# Altium schematic sheet SoC_1.SchDoc
size A3; SheetNumber: 5; SheetTotal: 10
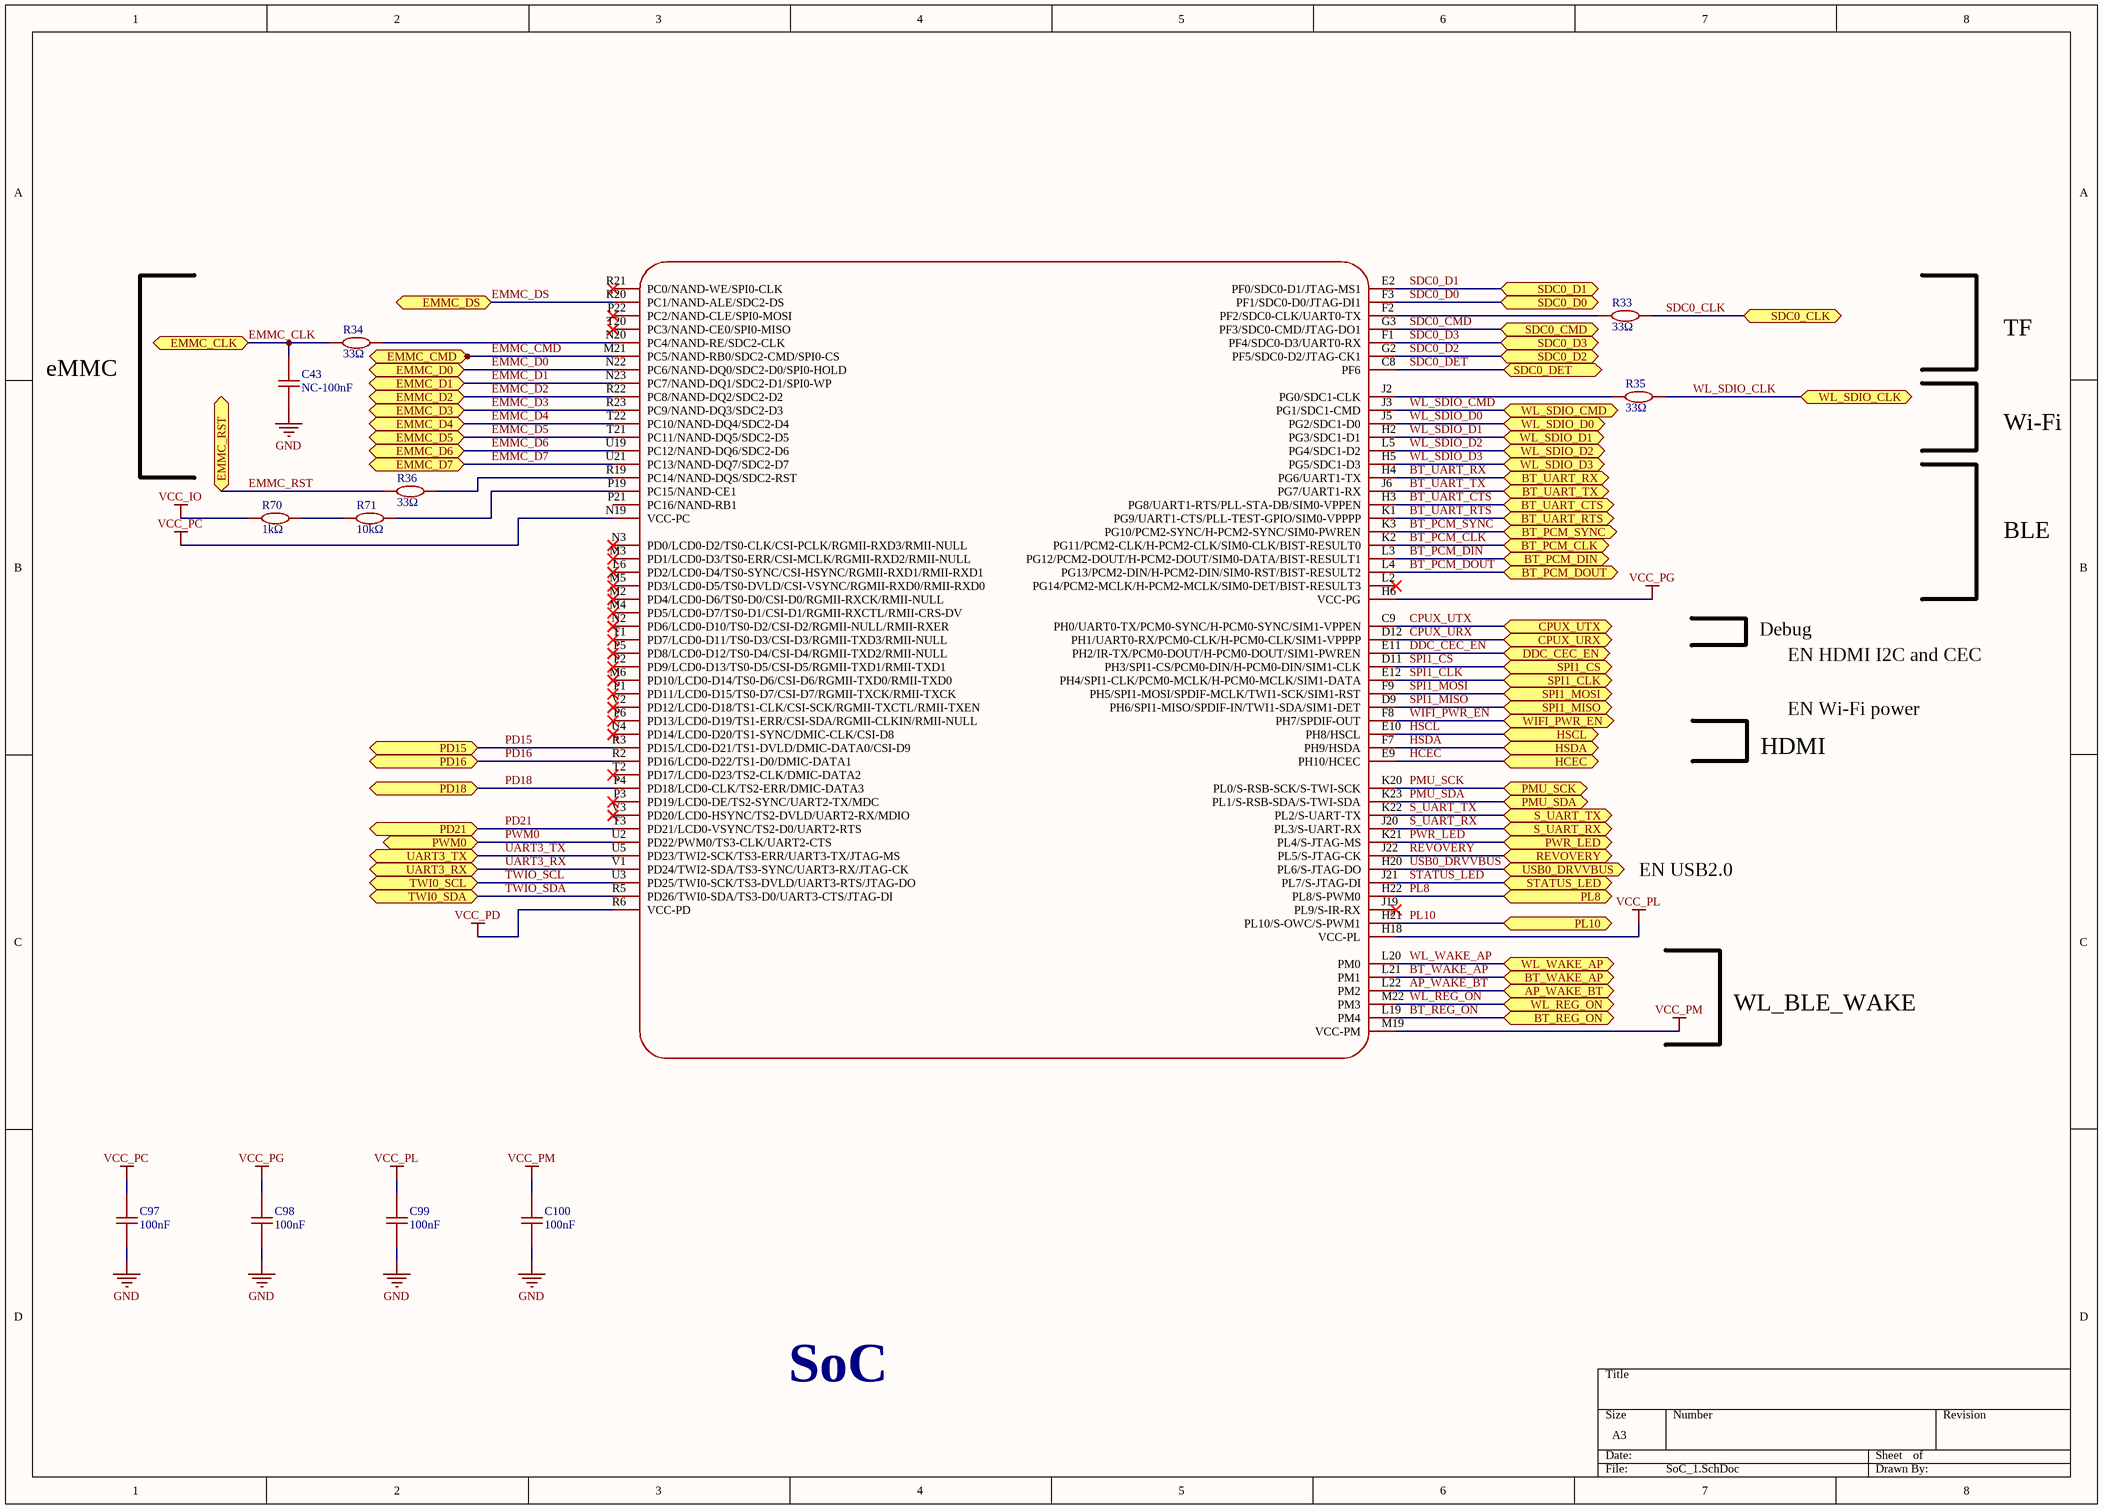
[diagram p0: SoC_1.SchDoc]

## Parts
C43  NC-100nF  [C0402]
C97  100nF  [C0402]
C98  100nF  [C0402]
C99  100nF  [C0402]
C100  100nF  [C0402]
R33  33Ω  [R0402]
R34  33Ω  [R0402]
R35  33Ω  [R0402]
R36  33Ω  [R0402]
R70  1kΩ  [R0402]
R71  10kΩ  [R0402]
U2  Allwinner_H6  [BGA451_ALLWINNER_H6]  (value not drawn)  (part B of 4)

## Ports
AP_WAKE_BT (bidir, see Wi-Fi[2B]), BT_PCM_CLK (bidir, see Wi-Fi[5B]), BT_PCM_DIN (bidir, see Wi-Fi[5B]), BT_PCM_DOUT (bidir, see Wi-Fi[5B]), BT_PCM_SYNC (bidir, see Wi-Fi[5B]), BT_REG_ON (bidir, see Wi-Fi[5B]), BT_UART_CTS (bidir, see Wi-Fi[5B]), BT_UART_RTS (bidir, see Wi-Fi[5B]), BT_UART_RX (bidir, see Wi-Fi[5B]), BT_UART_TX (bidir, see Wi-Fi[5B]), BT_WAKE_AP (bidir, see Wi-Fi[2B]), CPUX_URX (bidir, see GPIO[6A]), CPUX_UTX (bidir, see GPIO[6A]), DDC_CEC_EN (bidir, see Audio-HDMI[1C]), EMMC_CLK (bidir, see eMMC[3A]), EMMC_CMD (bidir, see eMMC[3A]), EMMC_D0 (bidir, see eMMC[3A]), EMMC_D1 (bidir, see eMMC[3A]), EMMC_D2 (bidir, see eMMC[3A]), EMMC_D3 (bidir, see eMMC[3A]), EMMC_D4 (bidir, see eMMC[3A]), EMMC_D5 (bidir, see eMMC[3A]), EMMC_D6 (bidir, see eMMC[3A]), EMMC_D7 (bidir, see eMMC[3A]), EMMC_DS (bidir, see eMMC[3A]), EMMC_RST (bidir, see eMMC[3A]), HCEC (bidir, see Audio-HDMI[2D]), HSCL (bidir, see Audio-HDMI[2C]), HSDA (bidir, see Audio-HDMI[2C]), PD15 (bidir, see GPIO[4A]), PD16 (bidir, see GPIO[4A]), PD18 (bidir, see GPIO[4A]), PD21 (bidir, see GPIO[4B]), PL8 (bidir, see GPIO[4B]), PL10 (bidir, see GPIO[1A]), PMU_SCK (bidir, see Power[4B]), PMU_SDA (bidir, see Power[4B]), PWM0 (bidir, see GPIO[1A]), PWR_LED (bidir, see GPIO[1C]), REVOVERY (bidir, see GPIO[8C]), S_UART_RX (bidir, see GPIO[4A]), S_UART_TX (bidir, see GPIO[4A]), SDC0_CLK (bidir, see TF-USB[1A]), SDC0_CMD (bidir, see TF-USB[1A]), SDC0_D0 (bidir, see TF-USB[1A]), SDC0_D1 (bidir, see TF-USB[1A]), SDC0_D2 (bidir, see TF-USB[1A]), SDC0_D3 (bidir, see TF-USB[1A]), SDC0_DET (bidir, see TF-USB[3B]), SPI1_CLK (bidir, see GPIO[1B]), SPI1_CS (bidir, see GPIO[4B]), SPI1_MISO (bidir, see GPIO[1B]), SPI1_MOSI (bidir, see GPIO[1B]), STATUS_LED (bidir, see GPIO[1C]), TWI0_SCL (bidir, see GPIO[1A]), TWI0_SDA (bidir, see GPIO[1A]), UART3_RX (bidir, see GPIO[1A]), UART3_TX (bidir, see GPIO[1A]), USB0_DRVVBUS (bidir, see TF-USB[4A]), WIFI_PWR_EN (bidir, see Wi-Fi[6A]), WL_REG_ON (bidir, see Wi-Fi[2B]), WL_SDIO_CLK (bidir, see Wi-Fi[1B]), WL_SDIO_CMD (bidir, see Wi-Fi[1B]), WL_SDIO_D0 (bidir, see Wi-Fi[1B]), WL_SDIO_D1 (bidir, see Wi-Fi[1B]), WL_SDIO_D2 (bidir, see Wi-Fi[1B]), WL_SDIO_D3 (bidir, see Wi-Fi[1B]), WL_WAKE_AP (bidir, see Wi-Fi[2B])

## Nets
GND: C43.1 C97.1 C98.1 C99.1 C100.1
VCC_IO: R70.1
VCC_PC: C97.2 U2.N19(VCC-PC)
VCC_PD: U2.R6(VCC-PD)
VCC_PG: C98.2 U2.H6(VCC-PG)
VCC_PL: C99.2 U2.H18(VCC-PL)
VCC_PM: C100.2 U2.M19(VCC-PM)
AP_WAKE_BT: U2.L22(PM2) ; port AP_WAKE_BT
BT_PCM_CLK: U2.K2(PG11/PCM2-CLK/H-PCM2-CLK/SIM0-CLK/BIST-RESULT0) ; port BT_PCM_CLK
BT_PCM_DIN: U2.L3(PG12/PCM2-DOUT/H-PCM2-DOUT/SIM0-DATA/BIST-RESULT1) ; port BT_PCM_DIN
BT_PCM_DOUT: U2.L4(PG13/PCM2-DIN/H-PCM2-DIN/SIM0-RST/BIST-RESULT2) ; port BT_PCM_DOUT
BT_PCM_SYNC: U2.K3(PG10/PCM2-SYNC/H-PCM2-SYNC/SIM0-PWREN) ; port BT_PCM_SYNC
BT_REG_ON: U2.L19(PM4) ; port BT_REG_ON
BT_UART_CTS: U2.H3(PG8/UART1-RTS/PLL-STA-DB/SIM0-VPPEN) ; port BT_UART_CTS
BT_UART_RTS: U2.K1(PG9/UART1-CTS/PLL-TEST-GPIO/SIM0-VPPPP) ; port BT_UART_RTS
BT_UART_RX: U2.H4(PG6/UART1-TX) ; port BT_UART_RX
BT_UART_TX: U2.J6(PG7/UART1-RX) ; port BT_UART_TX
BT_WAKE_AP: U2.L21(PM1) ; port BT_WAKE_AP
CPUX_URX: U2.D12(PH1/UART0-RX/PCM0-CLK/H-PCM0-CLK/SIM1-VPPPP) ; port CPUX_URX
CPUX_UTX: U2.C9(PH0/UART0-TX/PCM0-SYNC/H-PCM0-SYNC/SIM1-VPPEN) ; port CPUX_UTX
DDC_CEC_EN: U2.E11(PH2/IR-TX/PCM0-DOUT/H-PCM0-DOUT/SIM1-PWREN) ; port DDC_CEC_EN
EMMC_CLK: C43.2 R34.1 ; port EMMC_CLK
EMMC_CMD: U2.M21(PC5/NAND-RB0/SDC2-CMD/SPI0-CS) ; port EMMC_CMD
EMMC_D0: U2.N22(PC6/NAND-DQ0/SDC2-D0/SPI0-HOLD) ; port EMMC_D0
EMMC_D1: U2.N23(PC7/NAND-DQ1/SDC2-D1/SPI0-WP) ; port EMMC_D1
EMMC_D2: U2.R22(PC8/NAND-DQ2/SDC2-D2) ; port EMMC_D2
EMMC_D3: U2.R23(PC9/NAND-DQ3/SDC2-D3) ; port EMMC_D3
EMMC_D4: U2.T22(PC10/NAND-DQ4/SDC2-D4) ; port EMMC_D4
EMMC_D5: U2.T21(PC11/NAND-DQ5/SDC2-D5) ; port EMMC_D5
EMMC_D6: U2.U19(PC12/NAND-DQ6/SDC2-D6) ; port EMMC_D6
EMMC_D7: U2.U21(PC13/NAND-DQ7/SDC2-D7) ; port EMMC_D7
EMMC_DS: U2.R20(PC1/NAND-ALE/SDC2-DS) ; port EMMC_DS
EMMC_RST: R36.1 ; port EMMC_RST
HCEC: U2.E9(PH10/HCEC) ; port HCEC
HSCL: U2.E10(PH8/HSCL) ; port HSCL
HSDA: U2.F7(PH9/HSDA) ; port HSDA
PD15: U2.R3(PD15/LCD0-D21/TS1-DVLD/DMIC-DATA0/CSI-D9) ; port PD15
PD16: U2.R2(PD16/LCD0-D22/TS1-D0/DMIC-DATA1) ; port PD16
PD18: U2.P4(PD18/LCD0-CLK/TS2-ERR/DMIC-DATA3) ; port PD18
PD21: U2.T3(PD21/LCD0-VSYNC/TS2-D0/UART2-RTS) ; port PD21
PL8: U2.H22(PL8/S-PWM0) ; port PL8
PL10: U2.H21(PL10/S-OWC/S-PWM1) ; port PL10
PMU_SCK: U2.K20(PL0/S-RSB-SCK/S-TWI-SCK) ; port PMU_SCK
PMU_SDA: U2.K23(PL1/S-RSB-SDA/S-TWI-SDA) ; port PMU_SDA
PWM0: U2.U2(PD22/PWM0/TS3-CLK/UART2-CTS) ; port PWM0
PWR_LED: U2.K21(PL4/S-JTAG-MS) ; port PWR_LED
REVOVERY: U2.J22(PL5/S-JTAG-CK) ; port REVOVERY
S_UART_RX: U2.J20(PL3/S-UART-RX) ; port S_UART_RX
S_UART_TX: U2.K22(PL2/S-UART-TX) ; port S_UART_TX
SDC0_CLK: R33.2 ; port SDC0_CLK
SDC0_CMD: U2.G3(PF3/SDC0-CMD/JTAG-DO1) ; port SDC0_CMD
SDC0_D0: U2.F3(PF1/SDC0-D0/JTAG-DI1) ; port SDC0_D0
SDC0_D1: U2.E2(PF0/SDC0-D1/JTAG-MS1) ; port SDC0_D1
SDC0_D2: U2.G2(PF5/SDC0-D2/JTAG-CK1) ; port SDC0_D2
SDC0_D3: U2.F1(PF4/SDC0-D3/UART0-RX) ; port SDC0_D3
SDC0_DET: U2.C8(PF6) ; port SDC0_DET
SPI1_CLK: U2.E12(PH4/SPI1-CLK/PCM0-MCLK/H-PCM0-MCLK/SIM1-DATA) ; port SPI1_CLK
SPI1_CS: U2.D11(PH3/SPI1-CS/PCM0-DIN/H-PCM0-DIN/SIM1-CLK) ; port SPI1_CS
SPI1_MISO: U2.D9(PH6/SPI1-MISO/SPDIF-IN/TWI1-SDA/SIM1-DET) ; port SPI1_MISO
SPI1_MOSI: U2.F9(PH5/SPI1-MOSI/SPDIF-MCLK/TWI1-SCK/SIM1-RST) ; port SPI1_MOSI
STATUS_LED: U2.J21(PL7/S-JTAG-DI) ; port STATUS_LED
TWIO_SCL: U2.U3(PD25/TWI0-SCK/TS3-DVLD/UART3-RTS/JTAG-DO) ; port TWI0_SCL
TWIO_SDA: U2.R5(PD26/TWI0-SDA/TS3-D0/UART3-CTS/JTAG-DI) ; port TWI0_SDA
UART3_RX: U2.V1(PD24/TWI2-SDA/TS3-SYNC/UART3-RX/JTAG-CK) ; port UART3_RX
UART3_TX: U2.U5(PD23/TWI2-SCK/TS3-ERR/UART3-TX/JTAG-MS) ; port UART3_TX
USB0_DRVVBUS: U2.H20(PL6/S-JTAG-DO) ; port USB0_DRVVBUS
WIFI_PWR_EN: U2.F8(PH7/SPDIF-OUT) ; port WIFI_PWR_EN
WL_REG_ON: U2.M22(PM3) ; port WL_REG_ON
WL_SDIO_CLK: R35.2 ; port WL_SDIO_CLK
WL_SDIO_CMD: U2.J3(PG1/SDC1-CMD) ; port WL_SDIO_CMD
WL_SDIO_D0: U2.J5(PG2/SDC1-D0) ; port WL_SDIO_D0
WL_SDIO_D1: U2.H2(PG3/SDC1-D1) ; port WL_SDIO_D1
WL_SDIO_D2: U2.L5(PG4/SDC1-D2) ; port WL_SDIO_D2
WL_SDIO_D3: U2.H5(PG5/SDC1-D3) ; port WL_SDIO_D3
WL_WAKE_AP: U2.L20(PM0) ; port WL_WAKE_AP
NetR33_1: R33.1 U2.F2(PF2/SDC0-CLK/UART0-TX)
NetR34_2: R34.2 U2.N20(PC4/NAND-RE/SDC2-CLK)
NetR35_1: R35.1 U2.J2(PG0/SDC1-CLK)
NetR36_2: R36.2 U2.R19(PC14/NAND-DQS/SDC2-RST)
NetR70_2: R70.2 R71.1
NetR71_2: R71.2 U2.P19(PC15/NAND-CE1)

Not connected (* = marked no-connect by the designer): U2 J19(PL9/S-IR-RX)* L2(PG14/PCM2-MCLK/H-PCM2-MCLK/SIM0-DET/BIST-RESULT3)* L6(PD2/LCD0-D4/TS0-SYNC/CSI-HSYNC/RGMII-RXD1/RMII-RXD1)* M2(PD4/LCD0-D6/TS0-D0/CSI-D0/RGMII-RXCK/RMII-NULL)* M3(PD1/LCD0-D3/TS0-ERR/CSI-MCLK/RGMII-RXD2/RMII-NULL)* M4(PD5/LCD0-D7/TS0-D1/CSI-D1/RGMII-RXCTL/RMII-CRS-DV)* M5(PD3/LCD0-D5/TS0-DVLD/CSI-VSYNC/RGMII-RXD0/RMII-RXD0)* M6(PD10/LCD0-D14/TS0-D6/CSI-D6/RGMII-TXD0/RMII-TXD0)* N2(PD6/LCD0-D10/TS0-D2/CSI-D2/RGMII-NULL/RMII-RXER)* N3(PD0/LCD0-D2/TS0-CLK/CSI-PCLK/RGMII-RXD3/RMII-NULL)* P1(PD11/LCD0-D15/TS0-D7/CSI-D7/RGMII-TXCK/RMII-TXCK)* P2(PD9/LCD0-D13/TS0-D5/CSI-D5/RGMII-TXD1/RMII-TXD1)* P3(PD19/LCD0-DE/TS2-SYNC/UART2-TX/MDC)* P5(PD8/LCD0-D12/TS0-D4/CSI-D4/RGMII-TXD2/RMII-NULL)* P6(PD13/LCD0-D19/TS1-ERR/CSI-SDA/RGMII-CLKIN/RMII-NULL)* P21(PC16/NAND-RB1) P22(PC2/NAND-CLE/SPI0-MOSI)* R21(PC0/NAND-WE/SPI0-CLK)* T1(PD7/LCD0-D11/TS0-D3/CSI-D3/RGMII-TXD3/RMII-NULL)* T2(PD17/LCD0-D23/TS2-CLK/DMIC-DATA2)* T20(PC3/NAND-CE0/SPI0-MISO)* U4(PD14/LCD0-D20/TS1-SYNC/DMIC-CLK/CSI-D8)* V2(PD12/LCD0-D18/TS1-CLK/CSI-SCK/RGMII-TXCTL/RMII-TXEN)* V3(PD20/LCD0-HSYNC/TS2-DVLD/UART2-RX/MDIO)*

## Notes on the sheet
- eMMC
- TF
- Wi-Fi
- BLE
- Debug
- EN HDMI I2C and CEC
- EN Wi-Fi power
- HDMI
- EN USB2.0
- WL_BLE_WAKE
- SoC

## Library data of the parts
C43 = 100nF: 50V 100nF X7R ±10% 0603 Ceramic Capacitors ROHS
C97-C100 = 100nF: 50V 100nF X7R ±10% 0402 Ceramic Capacitors ROHS
R33-R36 = 33Ω: 62.5mW 33Ω 50V ±100ppm/℃ Thick Film Resistor ±1% 0402 Chip Resistor - Surface Mount ROHS
R70 = 1kΩ: 1kΩ 62.5mW 50V ±100ppm/℃ Thick Film Resistor ±1% 0402 Chip Resistor - Surface Mount ROHS
R71 = 10kΩ: 62.5mW 10kΩ 50V ±100ppm/℃ Thick Film Resistor ±1% 0402 Chip Resistor - Surface Mount ROHS
U2 = Allwinner_H6: Add into BOM: yes; Symbol: Allwinner_H6; Device: Allwinner_H6; Convert to PCB: yes